# Altium schematic sheet Batterycharger.SchDoc
size A4; DocumentNumber: 15; SheetNumber: ALT0056; SheetTotal: 21
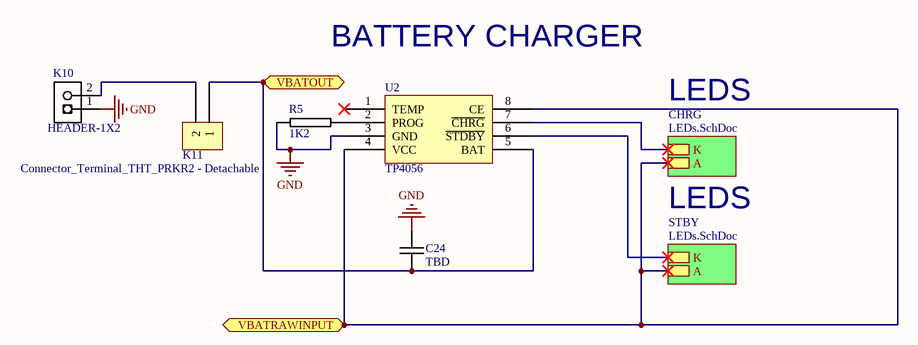
[diagram p0: Batterycharger.SchDoc]

## Parts
C24  TBD  [1210C-GENERIC]
K10  HEADER-1X2  [HEADER-1X2]
K11  Connector_Terminal_THT_PRKR2 - Detachable  [PRKR2-DET]
R5  1K2  [0603R-GENERIC]
U2  TP4056  [SO8_N]

## Sub-sheets
CHRG = LEDs.SchDoc: K, A
STBY = LEDs.SchDoc: K, A

## Ports
VBATOUT (out), VBATRAWINPUT (in)

## Nets
GND: C24.1 K10.1 R5.1 U2.3(GND)
VBATOUT: C24.2 K11.1 U2.5(BAT) ; port VBATOUT
VBATRAWINPUT: U2.4(VCC) U2.8(CE) ; port VBATRAWINPUT, sheet CHRG/A, sheet STBY/A
NetK10_2: K10.2 K11.2
NetR5_2: R5.2 U2.2(PROG)
NetU2_6: U2.6(~{STDBY}) ; sheet STBY/K
NetU2_7: U2.7(~{CHRG}) ; sheet CHRG/K

Not connected (* = marked no-connect by the designer): U2 1(TEMP)*

## Notes on the sheet
- BATTERY CHARGER
- LEDS
- Title
- Size:
- Date:
- A4
- Number:
- Time:
- Revision:
- Sheet
- of
- File:

## Library data of the parts
C24 = Passives_Capacitors_1210_1210C-TBD: CAPACITOR 1210 CERAMIC VALUE TO BE DETERMINED
K10 = HEADER-1X2: REEL: TH; Supplier 1: Digi-Key; Supplier Part Number 1: S1011E-36-ND
R5 = 0603R-1K2: GENERIC RESISTOR 0603; Manufacturer Part Number: RMCF 1/16 1.2K 1% R; Manufacturer: Stackpole Electronics Inc; Reel: R75; Supplier 1: Digi-Key; Supplier Part Number 1: RMCF0603FT1K20TR-ND